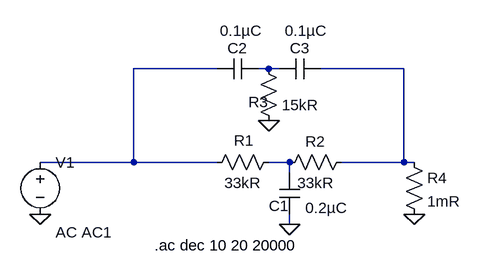
[diagram p0: schematic twin-notch.asc]
twin-notch.asc, the LTspice schematic file:
Version 4
SHEET 1 880 680
WIRE 96 -32 -32 -32
WIRE 176 -32 160 -32
WIRE 192 -32 176 -32
WIRE 384 -32 256 -32
WIRE -32 112 -32 -32
WIRE -32 112 -176 112
WIRE 96 112 -32 112
WIRE 208 112 176 112
WIRE 384 112 384 -32
WIRE 384 112 288 112
WIRE 400 112 384 112
WIRE 208 128 208 112
WIRE 208 208 208 192
FLAG 208 208 0
FLAG -176 192 0
FLAG 176 48 0
FLAG 400 192 0
SYMBOL res 192 96 R90
WINDOW 0 -2 54 VBottom 2
WINDOW 3 32 56 VTop 2
SYMATTR InstName R1
SYMATTR Value 33kR
SYMBOL cap 192 128 R0
WINDOW 0 -16 51 Left 2
WINDOW 3 40 54 Left 2
SYMATTR InstName C1
SYMATTR Value 0.2µC
SYMBOL res 304 96 R90
WINDOW 0 0 56 VBottom 2
WINDOW 3 32 56 VTop 2
SYMATTR InstName R2
SYMATTR Value 33kR
SYMBOL voltage -176 96 R0
WINDOW 123 24 124 Left 2
WINDOW 39 0 0 Left 0
SYMATTR Value2 AC AC1
SYMATTR InstName V1
SYMATTR Value ""
SYMBOL cap 160 -48 R90
WINDOW 0 0 32 VBottom 2
WINDOW 3 -58 27 VTop 2
SYMATTR InstName C2
SYMATTR Value 0.1µC
SYMBOL cap 256 -48 R90
WINDOW 0 0 32 VBottom 2
WINDOW 3 -58 23 VTop 2
SYMATTR InstName C3
SYMATTR Value 0.1µC
SYMBOL res 160 -48 R0
WINDOW 0 -15 67 Left 2
WINDOW 3 36 72 Left 2
SYMATTR InstName R3
SYMATTR Value 15kR
SYMBOL res 384 96 R0
SYMATTR InstName R4
SYMATTR Value 1mR
TEXT 0 240 Left 2 !.ac dec 10 20 20000

The netlist it stands for:
* twin-notch.asc
R1 N004 N001 33kR
C1 N004 0 0.2µC
R2 N003 N004 33kR
V1 N001 0 AC AC1
C2 N002 N001 0.1µC
C3 N003 N002 0.1µC
R3 N002 0 15kR
R4 N003 0 1mR
.ac dec 10 20 20000
.backanno
.end